# EAGLE design MdkController (EAGLE 7.3.0)
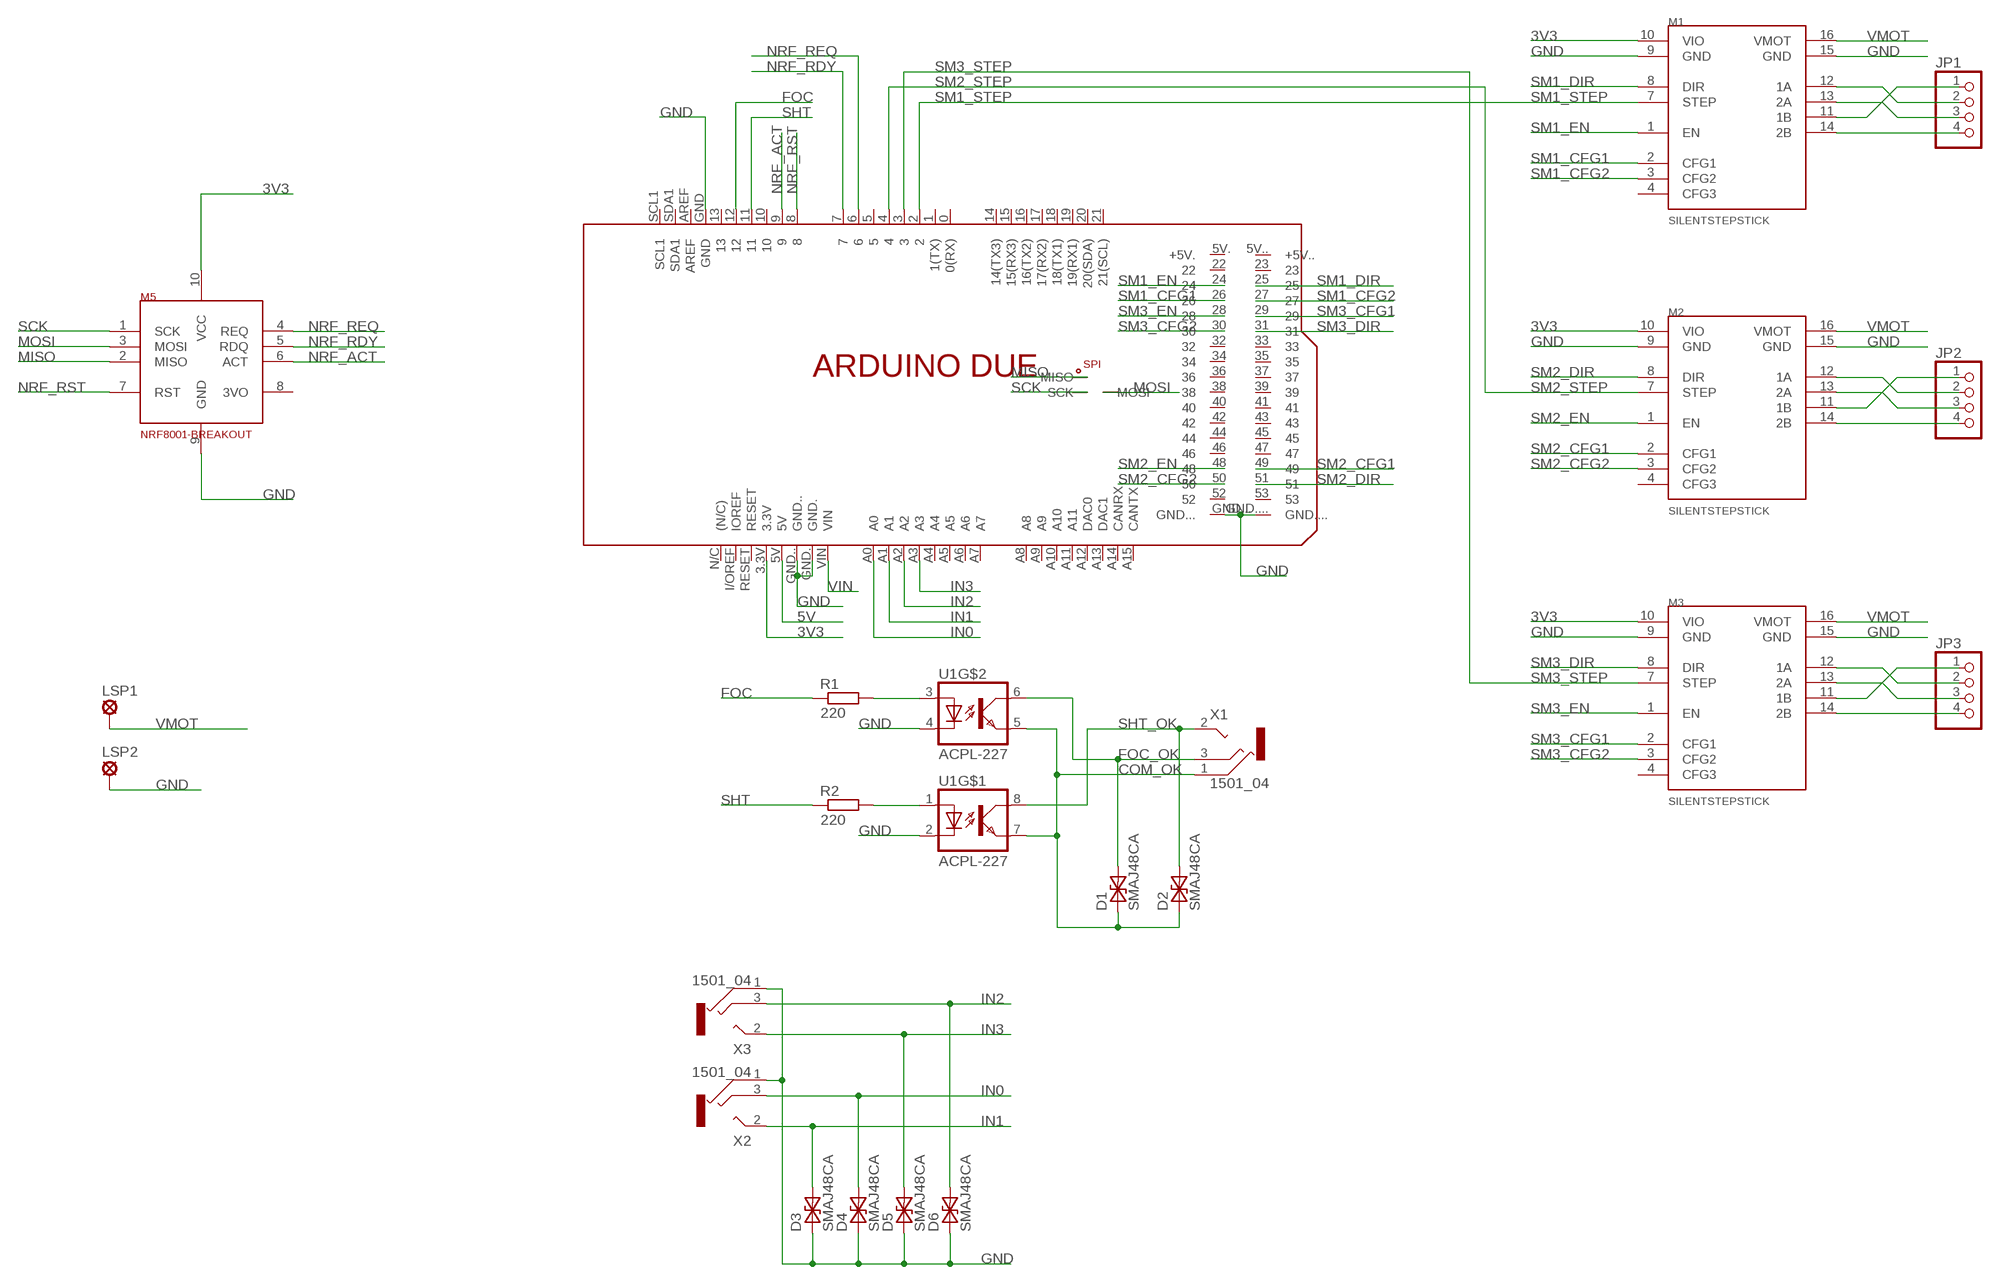
[diagram p0: schematic, sheet 1]

## Parts
D1  SMAJ48CA  [DO214AC]
D2  SMAJ48CA  [DO214AC]
D3  SMAJ48CA  [DO214AC]
D4  SMAJ48CA  [DO214AC]
D5  SMAJ48CA  [DO214AC]
D6  SMAJ48CA  [DO214AC]
JP1  PINHD-1X4  [1X04]
JP2  PINHD-1X4  [1X04]
JP3  PINHD-1X4  [1X04]
LSP1  SE14  [SE14]
LSP2  SE14  [SE14]
M1  SILENTSTEPSTICK  [SILENTSTEPSTICK]
M2  SILENTSTEPSTICK  [SILENTSTEPSTICK]
M3  SILENTSTEPSTICK  [SILENTSTEPSTICK]
M5  NRF8001-BREAKOUT  [NRF8001-BREAKOUT]
R1  220  R-EU_R0805  [R0805]
R2  220  R-EU_R0805  [R0805]
U1  ACPL-227  [SO8]
U$1  ARDUINO_DUE_PINS_ONLY  [ARDUINO_DUE_PINS_ONLY]
X1  1501_04  [1501_05]
X2  1501_04  [1501_05]
X3  1501_04  [1501_05]

## Nets
3V3 [power]: M1.10(VIO) M2.10(VIO) M3.10(VIO) M5.10(VCC) U$1.3.3V
5V: U$1.5V
COM_OK: D1.1 D2.1 U1.5(EMIT) U1.7(EMIT) X1.1
FOC: R1.1 U$1.12
FOC_OK: D1.2 U1.6(COL) X1.3
GND: D3.1 D4.1 D5.1 D6.1 LSP2.MP M1.9(GND) M1.15(GND) M2.9(GND) M2.15(GND) M3.9(GND) M3.15(GND) M5.9(GND) U1.2(C) U1.4(C) U$1.GND U$1.GND. U$1.GND.. U$1.GND... U$1.GND.... X2.1 X3.1
IN0: D4.2 U$1.A0 X2.3
IN1: D3.2 U$1.A1 X2.2
IN2: D6.2 U$1.A2 X3.3
IN3: D5.2 U$1.A3 X3.2
MISO: M5.2(MISO) U$1.MISO
MOSI: M5.3(MOSI) U$1.MOSI
N$1: R1.2 U1.3(A)
N$2: R2.2 U1.1(A)
N$3 [motor]: JP1.1 M1.11(1B)
N$4 [motor]: JP1.2 M1.12(1A)
N$8 [motor]: JP1.3 M1.13(2A)
N$10 [motor]: JP1.4 M1.14(2B)
N$11 [motor]: JP2.1 M2.11(1B)
N$12 [motor]: JP2.2 M2.12(1A)
N$14 [motor]: JP2.3 M2.13(2A)
N$15 [motor]: JP2.4 M2.14(2B)
N$16 [motor]: JP3.1 M3.11(1B)
N$17 [motor]: JP3.2 M3.12(1A)
N$18 [motor]: JP3.3 M3.13(2A)
N$19 [motor]: JP3.4 M3.14(2B)
NRF_ACT: M5.6(ACT) U$1.9
NRF_RDY: M5.5(RDQ) U$1.7
NRF_REQ: M5.4(REQ) U$1.6
NRF_RST: M5.7(RST) U$1.8
SCK: M5.1(SCK) U$1.SCK
SHT: R2.1 U$1.11
SHT_OK: D2.2 U1.8(COL) X1.2
SM1_CFG1: M1.2(CFG1) U$1.26
SM1_CFG2: M1.3(CFG2) U$1.27
SM1_DIR: M1.8(DIR) U$1.25
SM1_EN: M1.1(EN) U$1.24
SM1_STEP: M1.7(STEP) U$1.2
SM2_CFG1: M2.2(CFG1) U$1.49
SM2_CFG2: M2.3(CFG2) U$1.50
SM2_DIR: M2.8(DIR) U$1.51
SM2_EN: M2.1(EN) U$1.48
SM2_STEP: M2.7(STEP) U$1.4
SM3_CFG1: M3.2(CFG1) U$1.29
SM3_CFG2: M3.3(CFG2) U$1.30
SM3_DIR: M3.8(DIR) U$1.31
SM3_EN: M3.1(EN) U$1.28
SM3_STEP: M3.7(STEP) U$1.3
VIN [power]: U$1.VIN
VMOT [motor]: LSP1.MP M1.16(VMOT) M2.16(VMOT) M3.16(VMOT)
Unconnected: M1.4(CFG3) M2.4(CFG3) M3.4(CFG3) M5.8(3VO) U$1.0(0(RX)) U$1.1(1(TX)) U$1.5 U$1.5V.(+5V.) U$1.5V..(+5V..) U$1.10 U$1.13 U$1.14(14(TX3)) U$1.15(15(RX3)) U$1.16(16(TX2)) U$1.17(17(RX2)) U$1.18(18(TX1)) U$1.19(19(RX1)) U$1.20(20(SDA)) U$1.21(21(SCL)) U$1.22 U$1.23 U$1.32 U$1.33 U$1.34 U$1.35 U$1.36 U$1.37 U$1.38 U$1.39 U$1.40 U$1.41 U$1.42 U$1.43 U$1.44 U$1.45 U$1.46 U$1.47 U$1.52 U$1.53 U$1.+5V_ U$1.A4 U$1.A5 U$1.A6 U$1.A7 U$1.A8 U$1.A9 U$1.A10 U$1.A11 U$1.A12(DAC0) U$1.A13(DAC1) U$1.A14(CANRX) U$1.A15(CANTX) U$1.AREF U$1.GND__ U$1.I/OREF(IOREF) U$1.N/C((N/C)) U$1.RESET U$1.RESET. U$1.SCL1 U$1.SDA1

## Library data of the parts
D1-D6 = SMAJ_suppressors_CA_A:SMAJ*CA: SMAJxxCA Series of bidirectional Transient Voltage Suppressor Diodes xx = Stand-off Voltage VR in Volts; PPM = 400 W (300 W) @ 10/1000 us; IFSM = 40 A Case: SMA (JEDEC DO-214AC) Author: Dipl.-Ing. FH Rainer Bayer, www.ing-rb.de/hhn Feedback: rainer.bayer@hs-heilbronn.de
JP1-JP3 = pinhead:PINHD-1X4: PIN HEADER
LSP1 LSP2 = solpad:SE14: SOLDER PAD E1553, drill 1,4mm, distributor Buerklin, 07F820
M1-M3 = watterott:SILENTSTEPSTICK
M5 = mylibrary:NRF8001-BREAKOUT
R1 R2 = rcl:R-EU_: RESISTOR, European symbol
U1 = avago-acpl:ACPL-227
U$1 = E14_Arduino_revB:ARDUINO_DUE_PINS_ONLY
X1-X3 = con-lumberg-mod:1501_0*: Jack connectors according to JISC 6560, 2.5 mm Klinkensteckverbinder nach JISC 6560, 2,5 mm Source: http://www.lumberg.com/Produkte/PDFs/1501_05.pdfedit 1501_03 http://www.lumberg.com/Produkte/PDFs/1501_06.pdf; OC_FARNELL: 1216977; OC_NEWARK: unknown

## Net classes
0 signal: width 0.254 mm, drill 0.5 mm, clearance 0.203 mm
1 power: width 0.406 mm, drill 0.6 mm, clearance 0.254 mm
2 motor: width 0.813 mm, drill 0.5 mm, clearance 0.305 mm

## Board
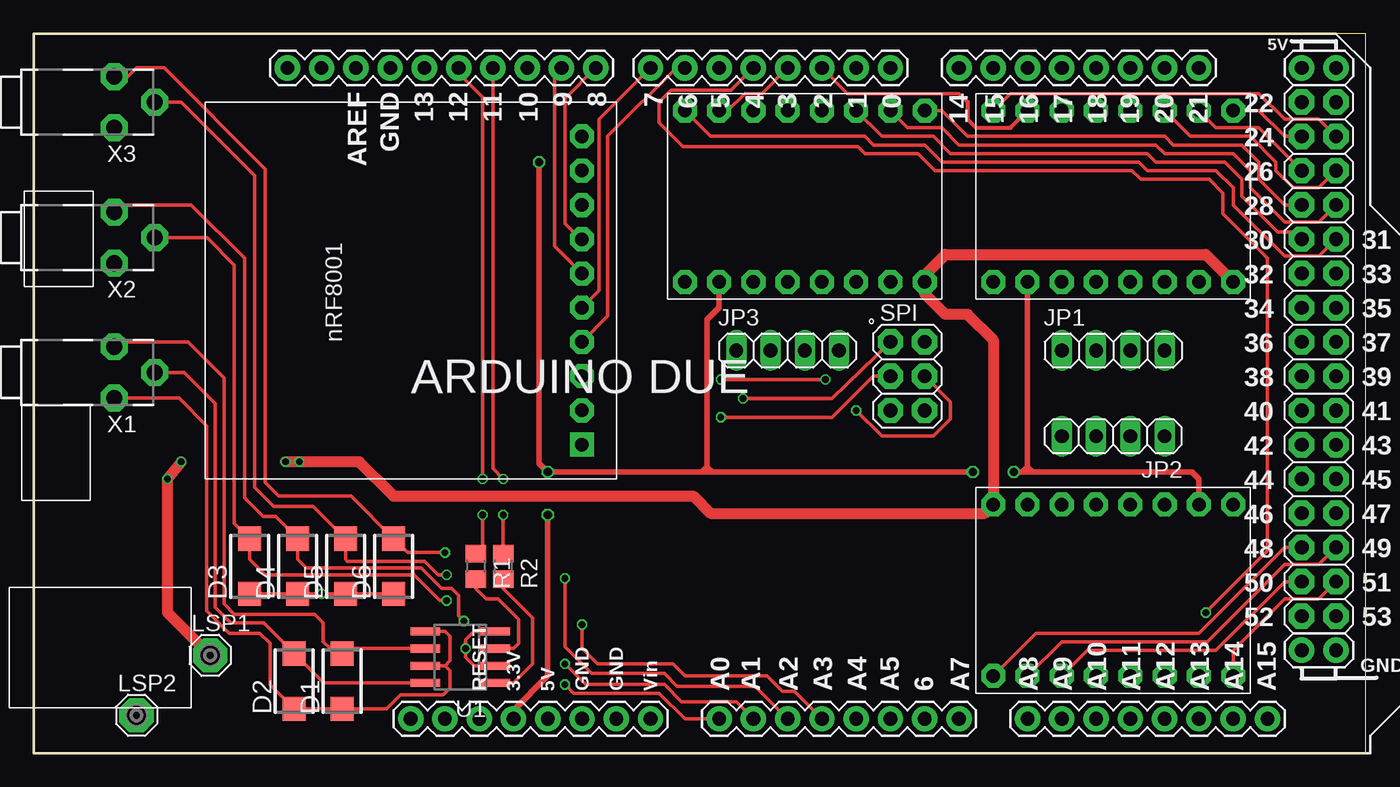
[diagram p1: board, top side]
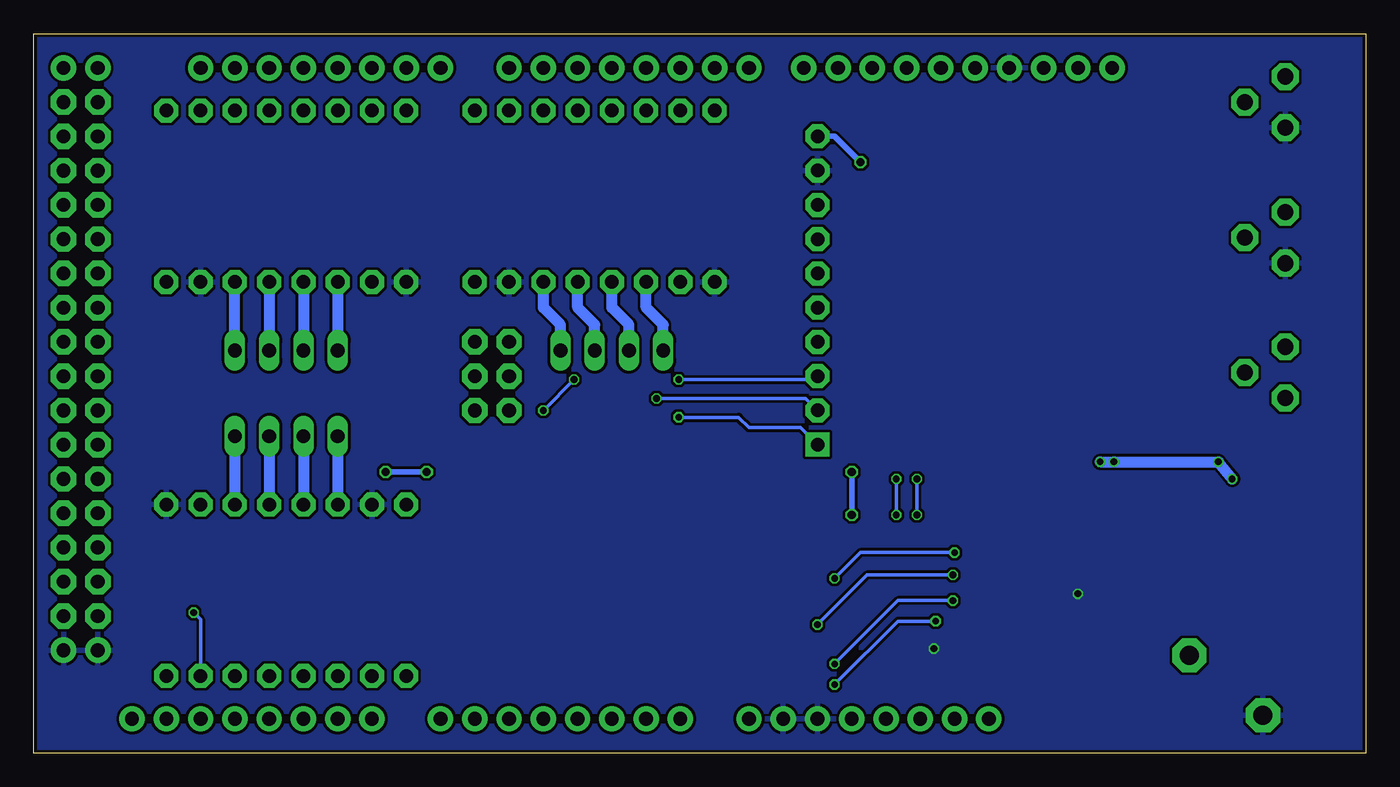
[diagram p2: board, bottom side, seen from below]

Size 98.73 x 53.33 mm. Coordinates in mm from the lower left corner, seen from the top.
Outline: 0,0 98.73,0 98.73,53.33 0,53.33 0,0
Copper layers (1*16): Top 0.018mm / dielectric 1.55mm / Bottom 0.018mm
Design rules "eC_2Layer_PClass6_BaseCopperO18_eCDefault": minimum track width 0.15mm, minimum drill 0.35mm, track to track 0.15mm, track to pad 0.15mm, pad to pad 0.15mm, via to via 0.15mm, smd to smd 0mil, copper to edge 0.25mm, drill to drill 0.35mm, minimum pad ring 0.175mm, minimum via ring 0.125mm, stop-mask expansion 0mil, vias tented up to drill 0.45mm, thermal gap 0.2mm

### Footprints (pad centres in the part's own frame; a part is rotated, then mirrored left to right if it is on the bottom)
DO214AC = smd 1.8 x 1.7: 1 -2.05,0; 2 2.05,0
1X04 = drill 1.016 long: 1 -3.81,0; 2 -1.27,0; 3 1.27,0; 4 3.81,0
SE14 = drill 1.397 pad 2.54 octagon: MP 0,0
SILENTSTEPSTICK = drill 1 pad 1.778 octagon: 1 12.7,0; 2 12.7,2.54; 3 12.7,5.08; 4 12.7,7.62; 5 12.7,10.16; 6 12.7,12.7; 7 12.7,15.24; 8 12.7,17.78; 9 0,17.78; 10 0,15.24; 11 0,12.7; 12 0,10.16; 13 0,7.62; 14 0,5.08; 15 0,2.54; 16 0,0
NRF8001-BREAKOUT = drill 1 pad 1.778 square: 1 0,0 | drill 1 pad 1.778 octagon: 2 0,2.54; 3 0,5.08; 4 0,7.62; 5 0,10.16; 6 0,12.7; 7 0,15.24; 8 0,17.78; 9 0,20.32; 10 0,22.86
R0805 = smd 1.3 x 1.5: 1 -0.95,0; 2 0.95,0
SO8 = smd 0.6 x 2.2: 1 -1.905,-2.6; 2 -0.635,-2.6; 3 0.635,-2.6; 4 1.905,-2.6; 5 1.905,2.6; 6 0.635,2.6; 7 -0.635,2.6; 8 -1.905,2.6
ARDUINO_DUE_PINS_ONLY = drill 1.016 pad 1.88: 0 63.5,50.8; 1 60.96,50.8; 2 58.42,50.8; 3 55.88,50.8; 3.3V 35.56,2.54; 4 53.34,50.8; 5 50.8,50.8; 5V 38.1,2.54; 5V. 93.98,50.8; 5V.. 96.52,50.8; 6 48.26,50.8; 7 45.72,50.8; 8 41.656,50.8; 9 39.116,50.8; 10 36.576,50.8; 11 34.036,50.8; 12 31.496,50.8; 14 68.58,50.8; 15 71.12,50.8; 16 73.66,50.8; 17 76.2,50.8; 18 78.74,50.8; 19 81.28,50.8; 20 83.82,50.8; 21 86.36,50.8; A0 50.8,2.54; A1 53.34,2.54; A2 55.88,2.54; A3 58.42,2.54; A4 60.96,2.54; A5 63.5,2.54; A6 66.04,2.54; A7 68.58,2.54; A8 73.66,2.54; A9 76.2,2.54; A10 78.74,2.54; A11 81.28,2.54; A12 83.82,2.54; A13 86.36,2.54; A14 88.9,2.54; A15 91.44,2.54; GND. 43.18,2.54; GND.. 40.64,2.54; GND... 93.98,7.62; GND.... 96.52,7.62; I/OREF 30.48,2.54; N/C 27.94,2.54; RESET 33.02,2.54; VIN 45.72,2.54 | drill 1 pad 1.88: 13 28.956,50.8; AREF 23.876,50.8; GND 26.416,50.8; SCL1 18.796,50.8; SDA1 21.336,50.8 | drill 1.016 pad 1.88 octagon: 22 93.98,48.26; 23 96.52,48.26; 24 93.98,45.72; 25 96.52,45.72; 26 93.98,43.18; 27 96.52,43.18; 28 93.98,40.64; 29 96.52,40.64; 30 93.98,38.1; 31 96.52,38.1; 32 93.98,35.56; 33 96.52,35.56; 34 93.98,33.02; 35 96.52,33.02; 36 93.98,30.48; 37 96.52,30.48; 38 93.98,27.94; 39 96.52,27.94; 40 93.98,25.4; 41 96.52,25.4; 42 93.98,22.86; 43 96.52,22.86; 44 93.98,20.32; 45 96.52,20.32; 46 93.98,17.78; 47 96.52,17.78; 48 93.98,15.24; 49 96.52,15.24; 50 93.98,12.7; 51 96.52,12.7; 52 93.98,10.16; 53 96.52,10.16; +5V_ 66.04,30.48; GND__ 66.04,25.4; MISO 63.5,30.48; MOSI 66.04,27.94; RESET. 63.5,25.4; SCK 63.5,27.94
1501_05 = drill 1.2 pad 2 octagon: 1 -1.9,-8.5; 2 0,-11.5; 3 1.9,-8.5

### Placement (x,y rotation side)
D1  22.86,5.33 90 top
D2  19.3,5.33 90 top
D3  16,13.84 90 top
D4  19.56,13.84 90 top
D5  23.11,13.84 90 top
D6  26.67,13.84 90 top
JP1  80.01,29.84 0 top
JP2  80.01,23.5 180 top
JP3  55.88,29.84 0 top
LSP1  13.08,7.24 0 top
LSP2  7.62,2.79 0 top
M1  88.9,34.92 90 top
M2  71.12,18.41 270 top
M3  66.04,34.92 90 top
M5  40.64,22.86 0 top
R1  32.77,13.84 270 top
R2  34.8,13.84 270 top
U1  31.62,7.11 90 top
U$1  0,0 0 top
X1  -2.54,28.22 90 top
X2  -2.54,38.21 90 top
X3  -2.54,48.26 90 top

### Tracks (layer width: path | path; a pad name or v marks a point on that pad's centre or on a via)
3V3  (via drill 0.6)
  Top 0.406: M2.10 86.36,20.32 85.85,20.83 74.04,20.83 | M1.10 73.66,21.21 | 73.66,21.21 73.66,20.83 | M3.10 50.8,33.02 49.91,32.13 49.91,21.21 | U$1.3.3V 35.56,3.17 38.1,5.71 v38.1,17.65 | 50.04,20.83 50.29,20.83 | 50.29,20.83 v69.6,20.83 | 73.28,20.83 73.66,20.83 | 73.66,20.83 74.04,20.83 | 49.91,21.21 49.91,20.95 50.04,20.83 | 50.04,20.83 49.53,20.83 | 73.28,20.83 73.66,21.21 | 73.66,21.21 74.04,20.83 | 49.53,20.83 49.91,21.21 | 49.91,21.21 50.29,20.83 | v72.64,20.83 73.28,20.83 | v37.47,43.81 37.47,21.46 v38.1,20.83 49.53,20.83
  Bottom 0.406: M5.10 39.37,45.72 v37.47,43.81 | v38.1,20.83 v38.1,17.65 | v69.6,20.83 v72.64,20.83
COM_OK
  Top 0.254: 30.48,6.48 30.86,6.1 30.86,4.83 30.35,4.32 27.18,4.32 26.14,3.28 D1.1 D2.1 17.53,5.06 17.53,8.13 16.76,8.89 14.48,8.89 12.83,10.54 12.83,24.26 10.76,26.32 X1.1 | U1.7 30.48,6.48 | 30.48,6.48 30.86,6.86 30.86,8.64 30.48,9.02 U1.5
FOC  (via drill 0.5)
  Top 0.254: U$1.12 31.5,50.42 33.27,48.64 v33.27,20.32 | R1.1 33.27,15.3 v33.27,17.65
  Bottom 0.254: v33.27,17.65 v33.27,20.32
FOC_OK
  Top 0.254: 21.95,7.75 U1.6 | 21.95,7.75 D1.2 | 21.95,7.75 21.46,8.24 21.46,9.65 20.83,10.29 14.86,10.29 14.1,11.05 14.1,27.81 11.43,30.48 6.35,30.48 5.99,30.12 X1.3
GND  (via drill 0.5)
  Top 0.254: U1.4 32.64,9.02 32,8.38 v32,7.75 32,7.11 32.64,6.48 U1.2 | D3.1 D4.1 20.68,11.79 v21.34,11.81 20.72,11.79 D5.1 D6.1
  pour Bottom: -1.27,-1.27 101.6,-1.27 101.6,54.61 -1.27,54.61
IN0  (via drill 0.5)
  Top 0.254: U$1.A0 48.26,2.54 46.35,4.45 40.01,4.45 v39.37,5.08 | v31.88,9.78 31.5,10.16 31.5,11.68 30.99,12.19 30.23,12.19 28.7,13.72 20.19,13.72 19.56,14.35 D4.2 17.93,17.53 17.02,17.53 15.62,18.92 15.62,36.7 11.68,40.64 6.49,40.64 X2.3
  Bottom 0.254: v31.88,9.78 34.67,9.78 v39.37,5.08
IN1  (via drill 0.5)
  Top 0.254: U$1.A1 52.07,3.81 48.01,3.81 46.74,5.08 40.89,5.08 v39.37,6.6 | v30.61,11.3 30.1,11.3 28.19,13.21 17.14,13.21 16,14.35 D3.2 14.86,17.04 14.86,36.2 12.84,38.21 X2.2
  Bottom 0.254: v30.61,11.3 34.67,11.3 v39.37,6.6
IN2  (via drill 0.5)
  Top 0.254: U$1.A2 53.47,4.95 47.69,4.95 46.74,5.91 41.34,5.91 39.37,7.87 v39.37,12.95 | v30.48,14.86 27.7,14.86 D6.2 23.51,19.05 18.16,19.05 17.14,20.07 17.14,43.31 9.65,50.8 7.62,50.8 6.98,50.16 X3.3
  Bottom 0.254: v30.48,14.86 37.47,14.86 v39.37,12.95
IN3  (via drill 0.5)
  Top 0.254: U$1.A3 56.39,4.57 55.5,4.57 54.36,5.71 48.26,5.71 47.37,6.6 41.78,6.6 40.64,7.75 v40.64,9.53 | v30.61,13.21 29.97,13.21 28.96,14.22 23.24,14.22 23.11,14.35 D5.2 20.72,18.29 17.78,18.29 16.38,19.68 16.38,42.8 10.92,48.26 X3.2
  Bottom 0.254: v30.61,13.21 36.96,13.21 v40.64,9.53
MISO  (via drill 0.5)
  Top 0.254: v52.58,26.29 59.18,26.29 U$1.MISO
  Bottom 0.254: M5.2 41.53,26.29 v52.58,26.29
MOSI  (via drill 0.5)
  Top 0.254: U$1.MOSI 67.94,26.04 67.94,24.77 66.67,23.5 62.87,23.5 v60.96,25.4 | v58.67,27.69 v50.93,27.69
  Bottom 0.254: v60.96,25.4 v58.67,27.69 | v50.93,27.69 40.89,27.69 M5.3
N$1
  Top 0.254: U1.3 35.56,7.75 35.94,8.13 35.94,9.91 34.42,11.43 33.53,11.43 32.77,12.19 R1.2
N$2
  Top 0.254: U1.1 35.56,5.21 36.96,6.6 36.96,10.03 34.8,12.19 R2.2
N$3
  Bottom 0.813: M1.11 JP1.1
N$4
  Bottom 0.813: M1.12 JP1.2
N$8
  Bottom 0.813: M1.13 JP1.3
N$10
  Bottom 0.813: JP1.4 M1.14
N$11
  Bottom 0.813: JP2.1 M2.11
N$12
  Bottom 0.813: JP2.2 M2.12
N$14
  Bottom 0.813: JP2.3 M2.13
N$15
  Bottom 0.813: JP2.4 M2.14
N$16
  Bottom 0.813: JP3.1 52.07,31.75 53.34,33.02 M3.11
N$17
  Bottom 0.813: JP3.2 54.61,31.75 55.88,33.02 M3.12
N$18
  Bottom 0.813: JP3.3 57.15,31.75 58.42,33.02 M3.13
N$19
  Bottom 0.813: JP3.4 59.69,31.75 60.96,33.02 M3.14
NRF_ACT
  Top 0.254: U$1.9 38.61,50.04 38.61,37.59 M5.6
NRF_RDY
  Top 0.254: U$1.7 41.91,46.99 41.91,34.29 M5.5
NRF_REQ
  Top 0.254: M5.4 42.55,32.38 42.55,45.72 47.62,50.8 U$1.6
NRF_RST
  Top 0.254: U$1.8 39.37,48.51 39.37,39.24 40.51,38.1 M5.7
SCK  (via drill 0.5)
  Top 0.254: v50.93,24.89 59.18,24.89 62.23,27.94 U$1.SCK
  Bottom 0.254: v50.93,24.89 46.48,24.89 45.72,24.13 41.91,24.13 M5.1
SHT  (via drill 0.5)
  Top 0.254: R2.1 v34.8,17.65 | v34.8,20.32 34.04,21.08 U$1.11
  Bottom 0.254: v34.8,17.65 v34.8,20.32
SHT_OK
  Top 0.254: X1.2 11.15,28.22 13.46,25.91 13.46,10.79 14.61,9.65 17.04,9.65 D2.2 21.48,5.21 U1.8
SM1_CFG1
  Top 0.254: M1.2 87.63,46.35 90.81,46.35 U$1.26
SM1_CFG2
  Top 0.254: U$1.27 95.25,41.91 93.34,41.91 92.08,43.18 92.08,43.81 90.17,45.72 85.72,45.72 M1.3
SM1_DIR
  Top 0.254: U$1.25 95.25,46.99 92.71,46.99 90.81,48.9 72.39,48.9 M1.8
SM1_EN
  Top 0.254: M1.1 90.81,47.62 92.71,45.72 U$1.24
SM1_STEP
  Top 0.254: U$1.2 60.33,48.9 68.58,48.9 69.22,48.26
  Top 0.305: 69.22,48.26 69.22,46.99 69.85,46.35 72.39,46.35 M1.7
SM2_CFG1
  Top 0.254: M2.2 76.2,8.26 87,8.26 92.71,13.97 95.25,13.97 U$1.49
SM2_CFG2
  Top 0.254: M2.3 78.11,7.62 87.63,7.62 92.71,12.7 U$1.50
SM2_DIR
  Top 0.254: M2.8 88.9,7.62 92.71,11.43 95.25,11.43 U$1.51
SM2_EN
  Top 0.254: 71.75,6.35 74.3,8.89 86.36,8.89 92.71,15.24 U$1.48
  Top 0.305: M2.1 71.75,6.35
SM2_STEP  (via drill 0.5)
  Top 0.254: U$1.4 51.69,49.15 47.24,49.15 46.35,48.26 46.35,46.74 48.13,44.96 61.09,44.96 61.59,44.45 65.53,44.45 66.8,43.18 81.41,43.18 82.04,42.55 87.12,42.55 88.14,41.53 88.14,40.01 91.44,36.7 91.44,14.99 v86.87,10.41
  Bottom 0.254: v86.87,10.41 86.36,9.91 M2.7
SM3_CFG1
  Top 0.254: M3.2 64.77,46.35 67.31,46.35 68.58,45.09 83.19,45.09 83.82,44.45 88.9,44.45 90.17,43.18 90.17,41.91 92.71,39.37 95.25,39.37 U$1.29
SM3_CFG2
  Top 0.254: U$1.30 93.47,38.61 92.2,38.61 89.53,41.27 89.53,42.55 88.27,43.81 83.19,43.81 82.55,44.45 67.94,44.45 66.67,45.72 62.87,45.72 M3.3
SM3_DIR
  Top 0.254: M3.8 50.16,45.72 61.59,45.72 62.23,45.09 66.04,45.09 67.31,43.81 81.92,43.81 82.55,43.18 87.63,43.18 88.9,41.91 88.9,40.64 92.71,36.83 95.25,36.83 U$1.31
SM3_EN
  Top 0.254: M3.1 67.31,47.62 69.22,45.72 83.82,45.72 84.45,45.09 89.53,45.09 90.81,43.81 90.81,42.55 92.71,40.64 U$1.28
SM3_STEP
  Top 0.254: U$1.3 53.98,48.9 52.7,48.9 51.44,47.62 M3.7
VMOT  (via drill 0.5)
  Top 0.813: M1.16 86.87,36.96 67.56,36.96 66.04,35.43 M3.16 66.04,34.04 67.56,32.51 69.22,32.51 71.12,30.61 M2.16 70.48,17.78 50.16,17.78 48.9,19.05 26.67,19.05 24.13,21.59 v19.68,21.59 v18.67,21.59 | v10.92,21.59 v9.91,20.32 9.91,10.41 LSP1.MP
  Bottom 0.813: v19.68,21.59 v18.67,21.59 v10.92,21.59 v9.91,20.32